# Altium schematic sheet PWM_schematic_2022-05-03.schdoc
size 214 x 152 mm
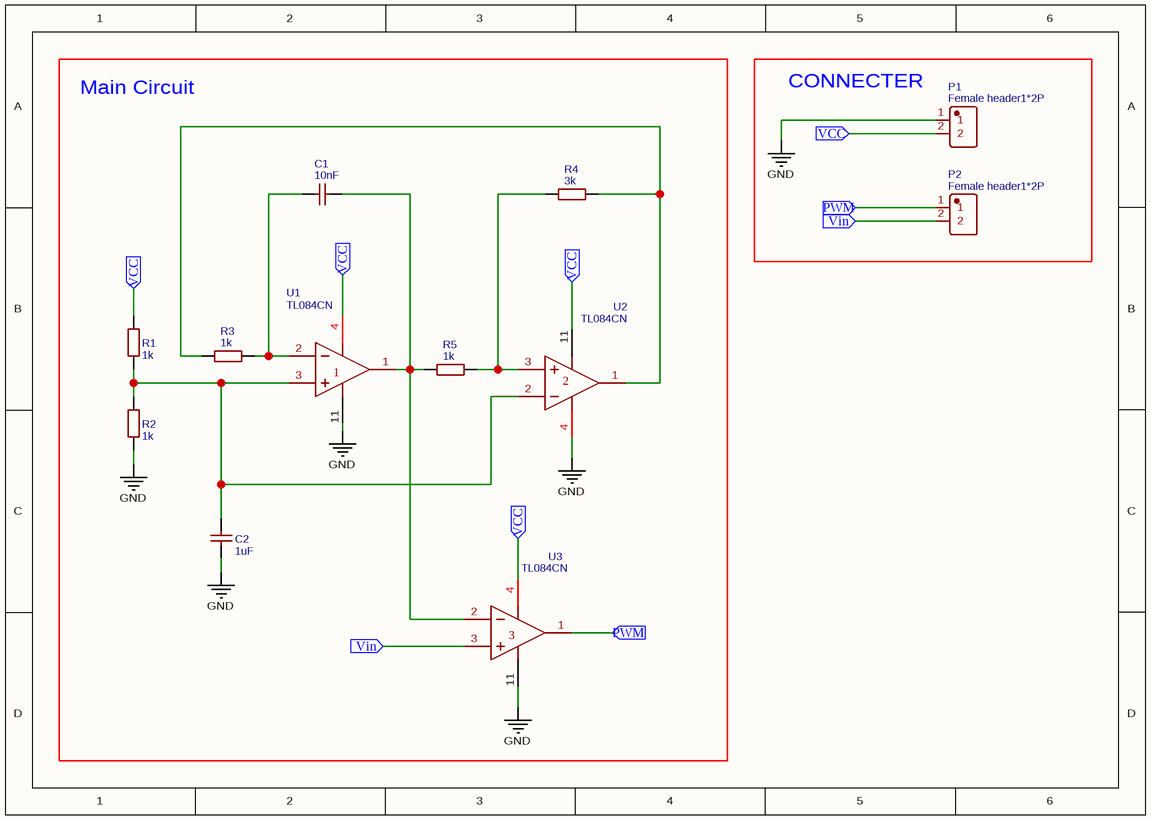
[diagram p0: PWM_schematic_2022-05-03.schdoc]

## Parts
C1  10nF  [CAP-TH_L3.5-W3.0-P2.54-D0.8]
C2  1uF  [CAP-TH_L3.5-W3.0-P2.54-D0.8]
P1  Female header1*2P  [HDR-TH_2P-P2.00-V-F-1]
P2  Female header1*2P  [HDR-TH_2P-P2.00-V-F-1]
R1  1k  [AXIAL-0.4]
R2  1k  [AXIAL-0.4]
R3  1k  [AXIAL-0.4]
R4  3k  [AXIAL-0.4]
R5  1k  [AXIAL-0.4]
U1  TL084CN  [DIP-14_L20.0-W7.6-P2.54-LS7.6-BL]
U2  TL084CN  [DIP-14_L20.0-W7.6-P2.54-LS7.6-BL]
U3  TL084CN  [DIP-14_L20.0-W7.6-P2.54-LS7.6-BL]

## Blocks framed on the sheet
Main Circuit: C1 C2 R1-R5 U1-U3
CONNECTER: P1 P2

## Ports
PWM (in), VCC (in), Vin (in)

## Nets
GND: C2.1 P1.1 R2.1 U1.11(V-) U2.4(V+) U3.11(V-)
PWM: P2.1 U3.1(OUT) ; port PWM
VCC: P1.2 R1.2 U1.4(V+) U2.11(V-) U3.4(V+) ; port VCC
Vin: P2.2 U3.3(IN+) ; port Vin
NetC1_1: C1.1 R3.2 U1.2(IN-)
NetC1_2: C1.2 R5.1 U1.1(OUT) U3.2(IN-)
NetC2_2: C2.2 R1.1 R2.2 U1.3(IN+) U2.2(IN-)
NetR3_1: R3.1 R4.2 U2.1(OUT)
NetR4_1: R4.1 R5.2 U2.3(IN+)

## Library data of the parts
C1 = 10nF: BOM_Manufacturer: ReliaPro; BOM_Manufacturer Part: 22pf/50V 10%; nameAlias: Capacitance; BOM_Supplier: LCSC; BOM_Supplier Part: C9316; spicePre: C; spiceSymbolName: 22pF
C2 = 1uF: BOM_Manufacturer: ReliaPro; BOM_Manufacturer Part: 22pf/50V 10%; nameAlias: Capacitance; BOM_Supplier: LCSC; BOM_Supplier Part: C9316; spicePre: C; spiceSymbolName: 22pF
P1 P2 = Female header1*2P: BOM_Manufacturer: BOOMELE; BOM_Supplier: LCSC; BOM_Manufacturer Part: Female header1*2P; BOM_Supplier Part: C66509; BOM_JLCPCB Part Class: Extended Part; spicePre: P; spiceSymbolName: Female header1*2P
R1-R3 R5 = 1k: BOM_Manufacturer: UniOhm; BOM_Manufacturer Part: MFR0W4F2200A50; Power: 1/4W; Tolerance: ±1%; BOM_EasyEDA: E57439; Value: Value; BOM_Supplier Part: E57439; BOM_Supplier: EasyEDA; spicePre: R; spiceSymbolName: RESISTOR
R4 = 3k: BOM_Manufacturer: UniOhm; BOM_Manufacturer Part: MFR0W4F2200A50; Power: 1/4W; Tolerance: ±1%; BOM_EasyEDA: E57439; Value: Value; BOM_Supplier Part: E57439; BOM_Supplier: EasyEDA; spicePre: R; spiceSymbolName: RESISTOR
U1-U3 = TL084CN: BOM_Manufacturer Part: STMicroelectronics; subpart_no: 1; BOM_Supplier Part: C5163; BOM_Supplier: LCSC; BOM_Manufacturer: TL084CN; image: http://image.lceda.cn/szlcsc/C5163.jpg; spicePre: U; spiceSymbolName: TL084CN